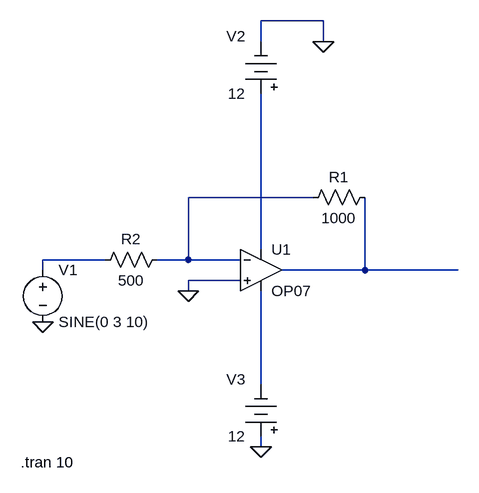
[diagram p0: schematic Neg Feedback.asc]
Neg Feedback.asc, the LTspice schematic file:
Version 4
SHEET 1 880 680
WIRE 368 -384 272 -384
WIRE 272 -352 272 -384
WIRE 368 -352 368 -384
WIRE 352 -112 160 -112
WIRE 272 -32 272 -272
WIRE 32 -16 -64 -16
WIRE 160 -16 160 -112
WIRE 160 -16 112 -16
WIRE 240 -16 160 -16
WIRE -64 0 -64 -16
WIRE 432 0 432 -112
WIRE 432 0 304 0
WIRE 576 0 432 0
WIRE 240 16 160 16
WIRE 160 32 160 16
WIRE 272 176 272 32
WIRE 272 272 272 256
FLAG 160 32 0
FLAG -64 80 0
FLAG 272 272 0
FLAG 368 -352 0
SYMBOL voltage -64 -16 R0
WINDOW 123 0 0 Left 0
WINDOW 39 0 0 Left 0
SYMATTR InstName V1
SYMATTR Value SINE(0 3 10)
SYMBOL Opamps\\OP07 272 -64 R0
SYMATTR InstName U1
SYMBOL Misc\\battery 272 -256 R180
WINDOW 0 24 104 Left 2
WINDOW 3 24 16 Left 2
WINDOW 123 0 0 Left 0
WINDOW 39 0 0 Left 0
SYMATTR InstName V2
SYMATTR Value 12
SYMBOL Misc\\battery 272 272 R180
WINDOW 0 24 104 Left 2
WINDOW 3 24 16 Left 2
WINDOW 123 0 0 Left 0
WINDOW 39 0 0 Left 0
SYMATTR InstName V3
SYMATTR Value 12
SYMBOL res 336 -96 R270
WINDOW 0 32 56 VTop 2
WINDOW 3 0 56 VBottom 2
SYMATTR InstName R1
SYMATTR Value 1000
SYMBOL res 128 -32 R90
WINDOW 0 0 56 VBottom 2
WINDOW 3 32 56 VTop 2
SYMATTR InstName R2
SYMATTR Value 500
TEXT -98 296 Left 2 !.tran 10

The netlist it stands for:
* Neg Feedback.asc
V1 N003 0 SINE(0 3 10)
XU1 0 N001 N002 N005 N004 LT1001  ; OP07, pins In+ In- V+ V- OUT
V2 N002 0 12
V3 0 N005 12
R1 N001 N004 1000
R2 N001 N003 500
.tran 10
.lib LTC.lib
.backanno
.end